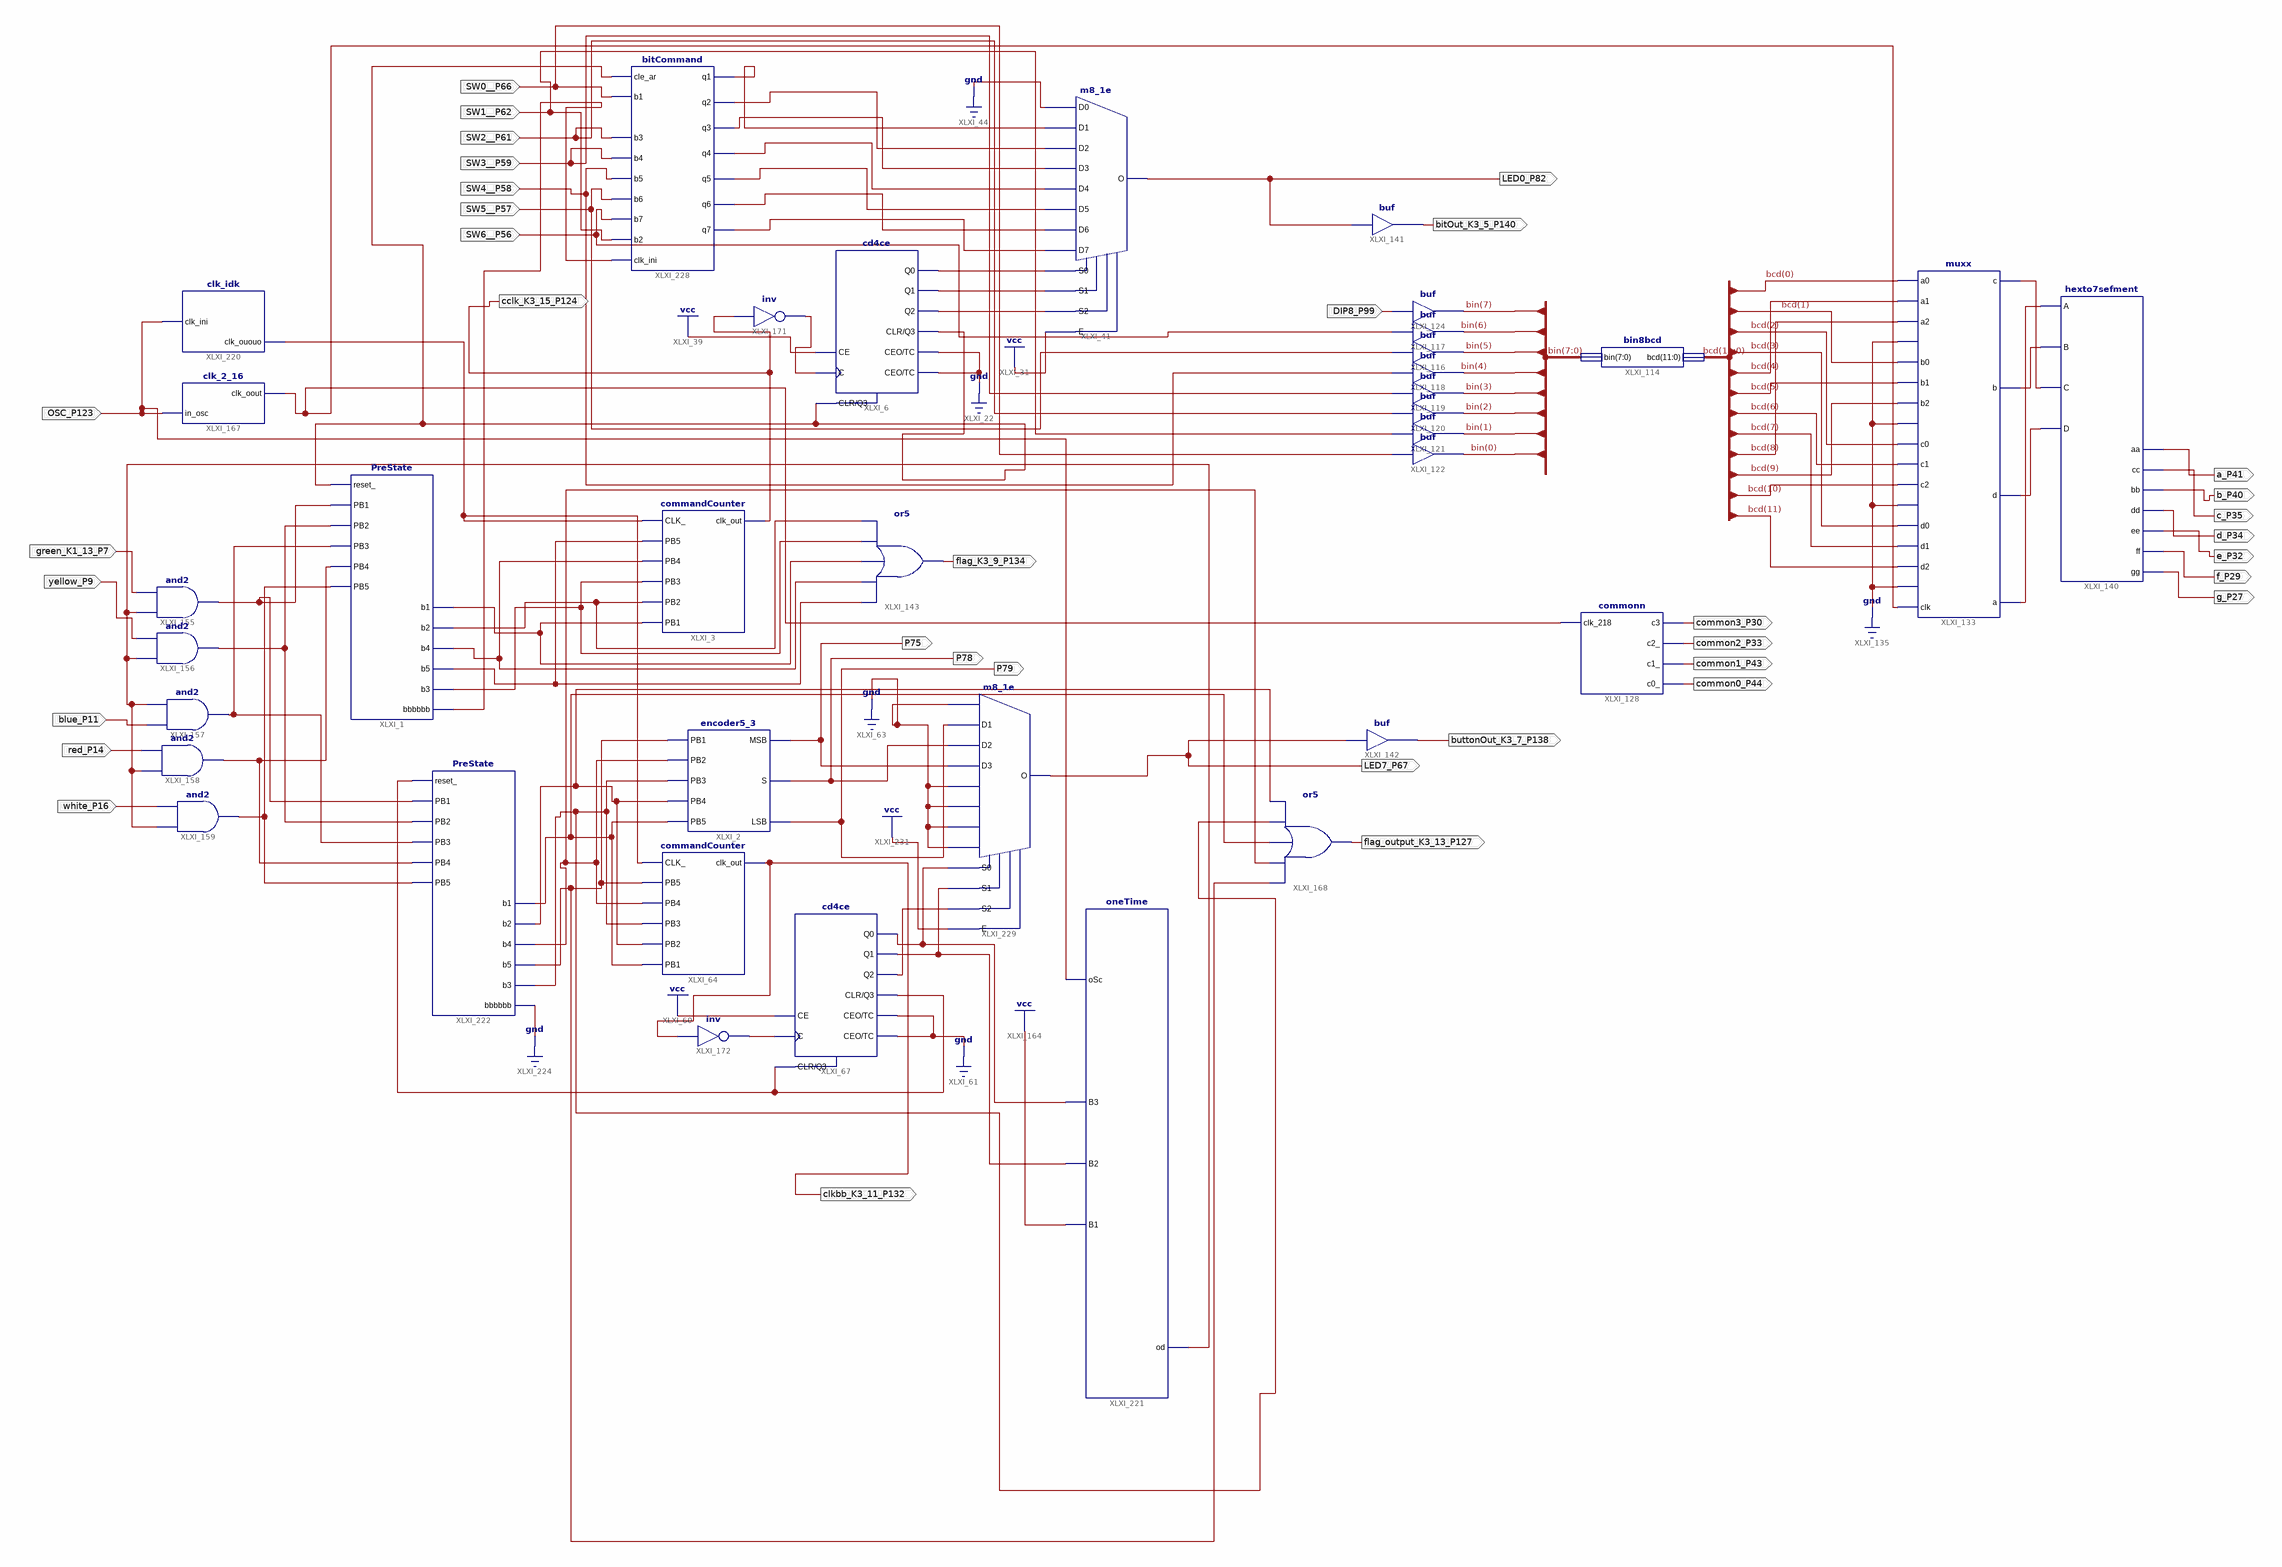
[diagram p0: schematic sheet 1]
// Xilinx ISE schematic mainCircuit.sch (spartan6) as structural Verilog: 36 symbols, 36 ports
module mainCircuit (
  input  SW0__P66,
  input  SW1__P62,
  input  SW2__P61,
  input  SW3__P59,
  input  SW4__P58,
  input  SW5__P57,
  input  SW6__P56,
  input  green_K1_13_P7,
  input  yellow_P9,
  input  blue_P11,
  input  red_P14,
  input  white_P16,
  input  DIP8_P99,
  input  OSC_P123,
  output P78,
  output LED0_P82,
  output LED7_P67,
  output P75,
  output P79,
  output common3_P30,
  output common2_P33,
  output common1_P43,
  output common0_P44,
  output a_P41,
  output b_P40,
  output c_P35,
  output e_P32,
  output f_P29,
  output g_P27,
  output d_P34,
  output bitOut_K3_5_P140,
  output flag_K3_9_P134,
  output cclk_K3_15_P124,
  output flag_output_K3_13_P127,
  output clkbb_K3_11_P132,
  output buttonOut_K3_7_P138
);

  wire clk_K3_15_P124, XLXN_159, XLXN_238, XLXN_256, XLXN_746, XLXN_747, XLXN_748, XLXN_749, XLXN_785,
       XLXN_787, XLXN_788, XLXN_791, XLXN_793, XLXN_804, XLXN_805, XLXN_842, XLXN_843, XLXN_844, XLXN_861,
       XLXN_862, XLXN_864, XLXN_865, XLXN_866, XLXN_867, XLXN_868, XLXN_890, XLXN_892, XLXN_894, XLXN_895,
       XLXN_896, XLXN_897, XLXN_922, XLXN_925, XLXN_943, XLXN_951, XLXN_958, XLXN_968, XLXN_969, XLXN_970,
       XLXN_972;
  wire [7:0] bin;
  wire [11:0] bcd;

  PreState XLXI_1 (
    .reset_(XLXN_943), .PB1(XLXN_785), .PB3(XLXN_791), .PB4(XLXN_788), .PB5(XLXN_787), .PB2(XLXN_793),
    .b2(XLXN_867), .b5(XLXN_238), .b1(XLXN_866), .b4(XLXN_159), .b3(XLXN_865), .bbbbbb(XLXN_922));
  commandCounter XLXI_3 (
    .CLK_(XLXN_868), .PB5(XLXN_238), .PB4(XLXN_159), .PB3(XLXN_865), .PB2(XLXN_867), .PB1(XLXN_866),
    .clk_out(cclk_K3_15_P124));
  cd4ce XLXI_6 (
    .C(XLXN_842), .CE(1'b1), .CLR(XLXN_943), .CEO(1'b0), .Q0(XLXN_925), .Q1(XLXN_804), .Q2(XLXN_805),
    .Q3(XLXN_943), .TC(1'b0));
  encoder5_3 XLXI_2 (
    .PB1(XLXN_256), .PB2(XLXN_864), .PB3(XLXN_958), .PB4(XLXN_862), .PB5(XLXN_861), .MSB(P75), .S(P78),
    .LSB(P79));
  commandCounter XLXI_64 (
    .CLK_(XLXN_868), .PB5(XLXN_256), .PB4(XLXN_864), .PB3(XLXN_958), .PB2(XLXN_862), .PB1(XLXN_861),
    .clk_out(clkbb_K3_11_P132));
  bin8bcd XLXI_114 (.bin(bin), .bcd(bcd));
  buf XLXI_117 (bin[6], SW6__P56);
  buf XLXI_118 (bin[4], SW4__P58);
  buf XLXI_119 (bin[3], SW3__P59);
  buf XLXI_120 (bin[2], SW2__P61);
  buf XLXI_121 (bin[1], SW1__P62);
  buf XLXI_122 (bin[0], SW0__P66);
  buf XLXI_116 (bin[5], SW5__P57);
  commonn XLXI_128 (
    .clk_218(clk_K3_15_P124), .c3(common3_P30), .c2_(common2_P33), .c1_(common1_P43), .c0_(common0_P44));
  buf XLXI_124 (bin[7], DIP8_P99);
  muxx XLXI_133 (
    .a0(bcd[0]), .a1(bcd[4]), .a2(bcd[8]), .a3(1'b0), .b0(bcd[1]), .b1(bcd[5]), .b2(bcd[9]), .b3(1'b0),
    .c0(bcd[2]), .c1(bcd[6]), .c2(bcd[10]), .c3(1'b0), .d0(bcd[3]), .d1(bcd[7]), .d2(bcd[11]), .d3(1'b0),
    .clk(clk_K3_15_P124), .c(XLXN_749), .b(XLXN_748), .d(XLXN_746), .a(XLXN_747));
  hexto7sefment XLXI_140 (
    .A(XLXN_747), .B(XLXN_748), .C(XLXN_749), .D(XLXN_746), .aa(a_P41), .cc(c_P35), .bb(b_P40), .dd(d_P34),
    .ee(e_P32), .ff(f_P29), .gg(g_P27));
  buf XLXI_141 (bitOut_K3_5_P140, LED0_P82);
  or XLXI_143 (flag_K3_9_P134, XLXN_238, XLXN_159, XLXN_866, XLXN_865, XLXN_867);
  and XLXI_155 (XLXN_785, XLXN_844, green_K1_13_P7);
  and XLXI_156 (XLXN_793, XLXN_844, yellow_P9);
  and XLXI_157 (XLXN_791, blue_P11, XLXN_844);
  and XLXI_158 (XLXN_788, XLXN_844, red_P14);
  and XLXI_159 (XLXN_787, XLXN_844, white_P16);
  clk_2_16 XLXI_167 (.clk_oout(clk_K3_15_P124), .in_osc(OSC_P123));
  or XLXI_168 (flag_output_K3_13_P127, XLXN_256, XLXN_864, XLXN_861, XLXN_958, XLXN_862);
  not XLXI_171 (XLXN_842, cclk_K3_15_P124);
  not XLXI_172 (XLXN_843, clkbb_K3_11_P132);
  clk_idk XLXI_220 (.clk_ini(OSC_P123), .clk_ououo(XLXN_868));
  oneTime XLXI_221 (.oSc(OSC_P123), .B3(XLXN_970), .B2(XLXN_968), .B1(1'b1), .od(XLXN_844));
  PreState XLXI_222 (
    .reset_(XLXN_969), .PB1(XLXN_785), .PB3(XLXN_791), .PB4(XLXN_788), .PB5(XLXN_787), .PB2(XLXN_793),
    .b2(XLXN_862), .b5(XLXN_256), .b1(XLXN_861), .b4(XLXN_864), .b3(XLXN_958), .bbbbbb(1'b0));
  bitCommand XLXI_228 (
    .cle_ar(XLXN_943), .b1(SW0__P66), .b3(SW2__P61), .b4(SW3__P59), .b5(SW4__P58), .b6(SW5__P57),
    .b7(SW6__P56), .b2(SW1__P62), .q1(XLXN_890), .q2(XLXN_892), .q3(XLXN_951), .q4(XLXN_894), .q5(XLXN_895),
    .q6(XLXN_896), .q7(XLXN_897), .clk_ini(XLXN_922));
  m8_1e XLXI_41 (
    .D0(1'b0), .D1(XLXN_890), .D2(XLXN_892), .D3(XLXN_951), .D4(XLXN_894), .D5(XLXN_895), .D6(XLXN_896),
    .D7(XLXN_897), .E(1'b1), .S0(XLXN_925), .S1(XLXN_804), .S2(XLXN_805), .O(LED0_P82));
  m8_1e XLXI_229 (
    .D0(1'b0), .D1(P79), .D2(P78), .D3(P75), .D4(1'b0), .D5(1'b0), .D6(1'b0), .D7(1'b0), .E(1'b1),
    .S0(XLXN_970), .S1(XLXN_968), .S2(XLXN_972), .O(LED7_P67));
  buf XLXI_142 (buttonOut_K3_7_P138, LED7_P67);
  cd4ce XLXI_67 (
    .C(XLXN_843), .CE(1'b1), .CLR(XLXN_969), .CEO(1'b0), .Q0(XLXN_970), .Q1(XLXN_968), .Q2(XLXN_972),
    .Q3(XLXN_969), .TC(1'b0));
endmodule
